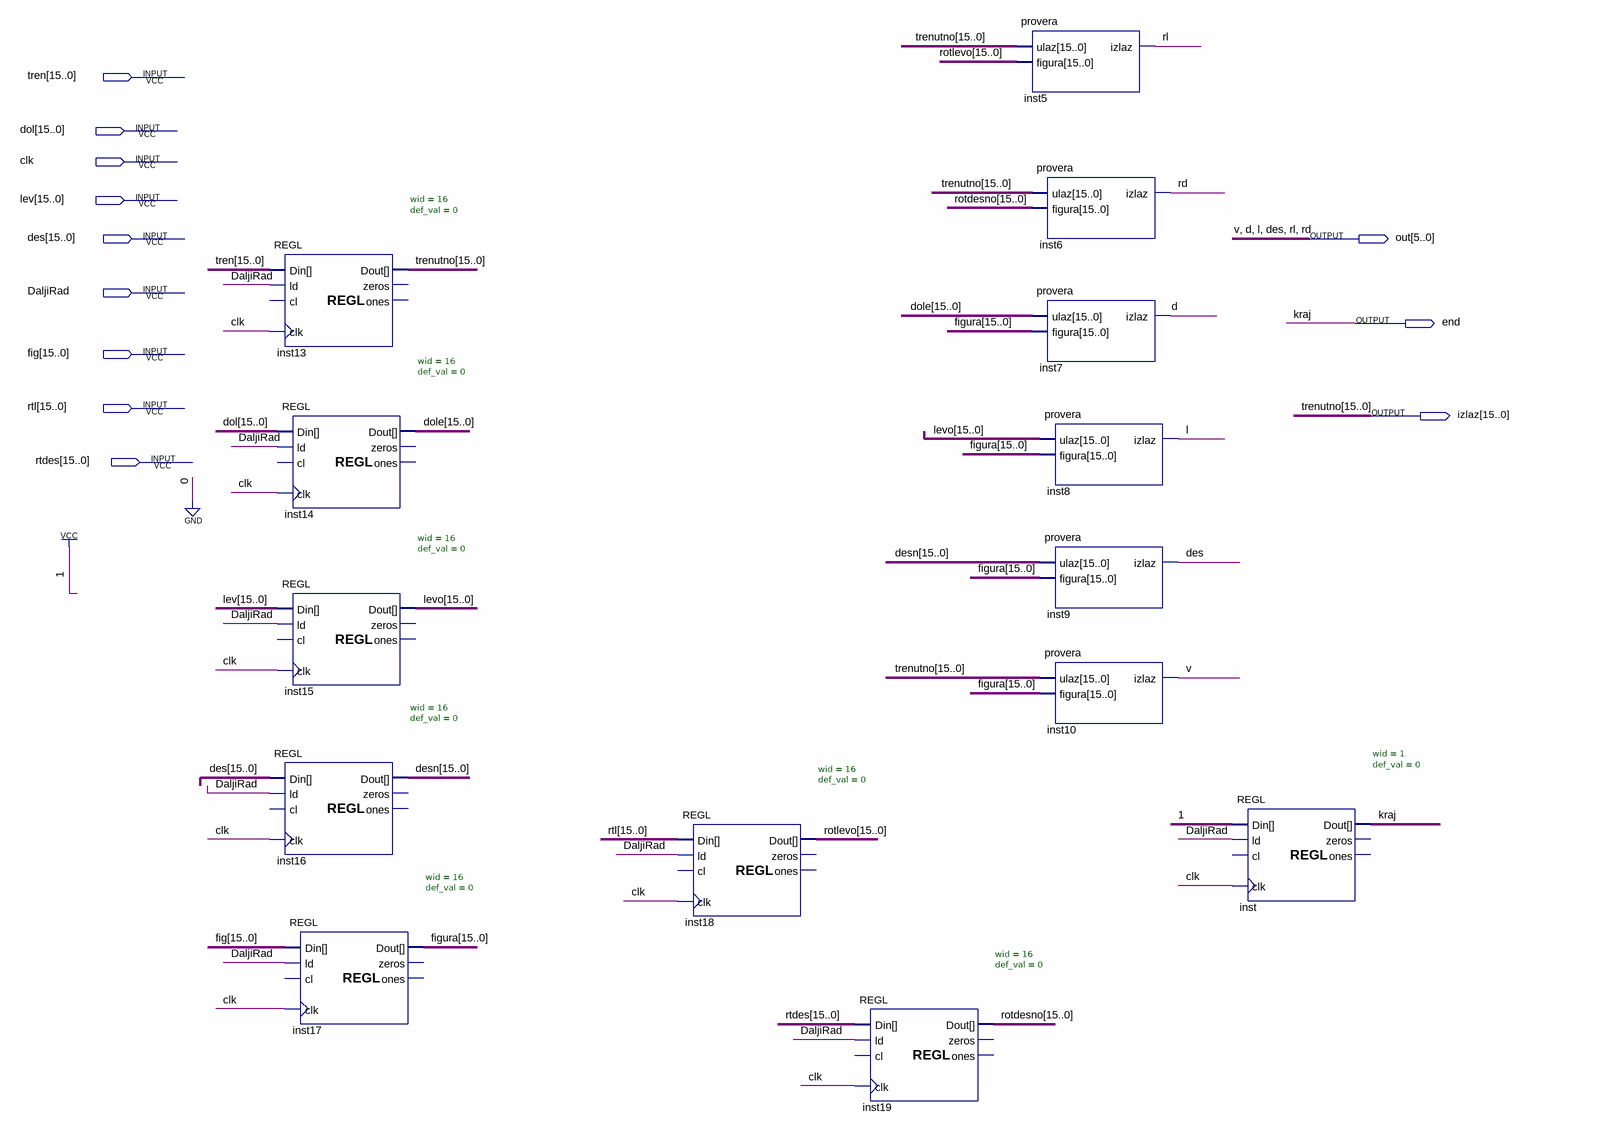
[diagram p0: schematic sheet]
// Quartus schematic utvrdjivanje.bdf as structural Verilog: 14 symbols, 12 pins
module utvrdjivanje (
  input  [15:0] tren,
  input  [15:0] dol,
  input  clk,
  input  [15:0] lev,
  input  [15:0] des,
  input  DaljiRad,
  input  [15:0] fig,
  input  [15:0] rtl,
  input  [15:0] rtdes,
  output [5:0] out,
  output \end ,
  output [15:0] izlaz
);

  wire [15:0] desn, dole, figura, levo, rotdesno, rotlevo;

  REGL #(.wid(16), .def_val(0)) inst13 (.Din(tren), .ld(DaljiRad), .clk(clk), .Dout(izlaz));  // open: cl, zeros, ones
  REGL #(.wid(16), .def_val(0)) inst14 (.Din(dol), .ld(DaljiRad), .clk(clk), .Dout(dole));  // open: cl, zeros, ones
  REGL #(.wid(16), .def_val(0)) inst15 (.Din(lev), .ld(DaljiRad), .clk(clk), .Dout(levo));  // open: cl, zeros, ones
  REGL #(.wid(16), .def_val(0)) inst16 (.Din(des), .ld(DaljiRad), .clk(clk), .Dout(desn));  // open: cl, zeros, ones
  REGL #(.wid(16), .def_val(0)) inst17 (.Din(fig), .ld(DaljiRad), .clk(clk), .Dout(figura));  // open: cl, zeros, ones
  REGL #(.wid(16), .def_val(0)) inst18 (.Din(rtl), .ld(DaljiRad), .clk(clk), .Dout(rotlevo));  // open: cl, zeros, ones
  REGL #(.wid(16), .def_val(0)) inst19 (
    .Din(rtdes), .ld(DaljiRad), .clk(clk), .Dout(rotdesno));  // open: cl, zeros, ones
  provera inst5 (.ulaz(izlaz), .figura(rotlevo), .izlaz(out[1]));
  provera inst6 (.ulaz(izlaz), .figura(rotdesno), .izlaz(out[0]));
  provera inst7 (.ulaz(dole), .figura(figura), .izlaz(out[4]));
  provera inst8 (.ulaz(levo), .figura(figura), .izlaz(out[3]));
  provera inst9 (.ulaz(desn), .figura(figura), .izlaz(out[2]));
  provera inst10 (.ulaz(izlaz), .figura(figura), .izlaz(out[5]));
  REGL #(.wid(1), .def_val(0)) inst (.Din(1'b1), .ld(DaljiRad), .clk(clk), .Dout(\end ));  // open: cl, zeros, ones

  // Other names for the same wires on the sheet: d = out[4]; des = out[2]; kraj = \end ; l = out[3]; rd = out[0];
  //   rl = out[1]; trenutno[15:0] = izlaz; v = out[5]
endmodule
